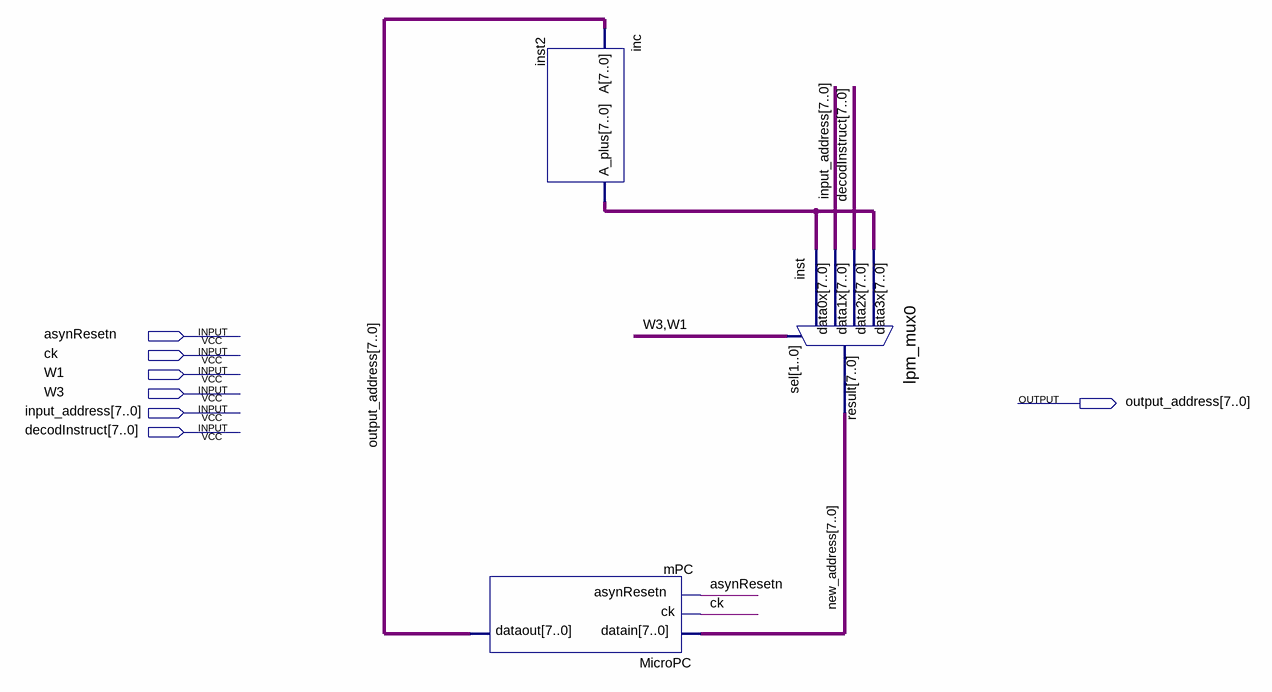
[diagram p0: schematic sheet]
// Quartus schematic sequencer.bdf as structural Verilog: 3 symbols, 7 pins
module sequencer (
  input  asynResetn,
  input  ck,
  input  W1,
  input  W3,
  input  [7:0] input_address,
  input  [7:0] decodInstruct,
  output [7:0] output_address
);

  wire [7:0] inst2_a_plus, new_address;

  inc inst2 (.A(output_address), .A_plus(inst2_a_plus));
  MicroPC mPC (.datain(new_address), .ck(ck), .asynResetn(asynResetn), .dataout(output_address));
  lpm_mux0 inst (
    .data3x(inst2_a_plus), .data2x(decodInstruct), .data1x(input_address), .data0x(inst2_a_plus),
    .sel({W3, W1}), .result(new_address));
endmodule
